# EasyEDA Pro project ProPrj_auduino温控灯扩展板_2024-11-21.epro

# Schematic Sheet_1_2024-11-05_ascii
Board Name: Sheet_1_2024-11-05_ascii; Create Date: 2024-11-08; Page Name: Sheet_1_2024-11-05_ascii; Project Name: auduino温控灯扩展板; Schematic Name: Sheet_1_2024-11-05_ascii; Update Date: 2024-11-08
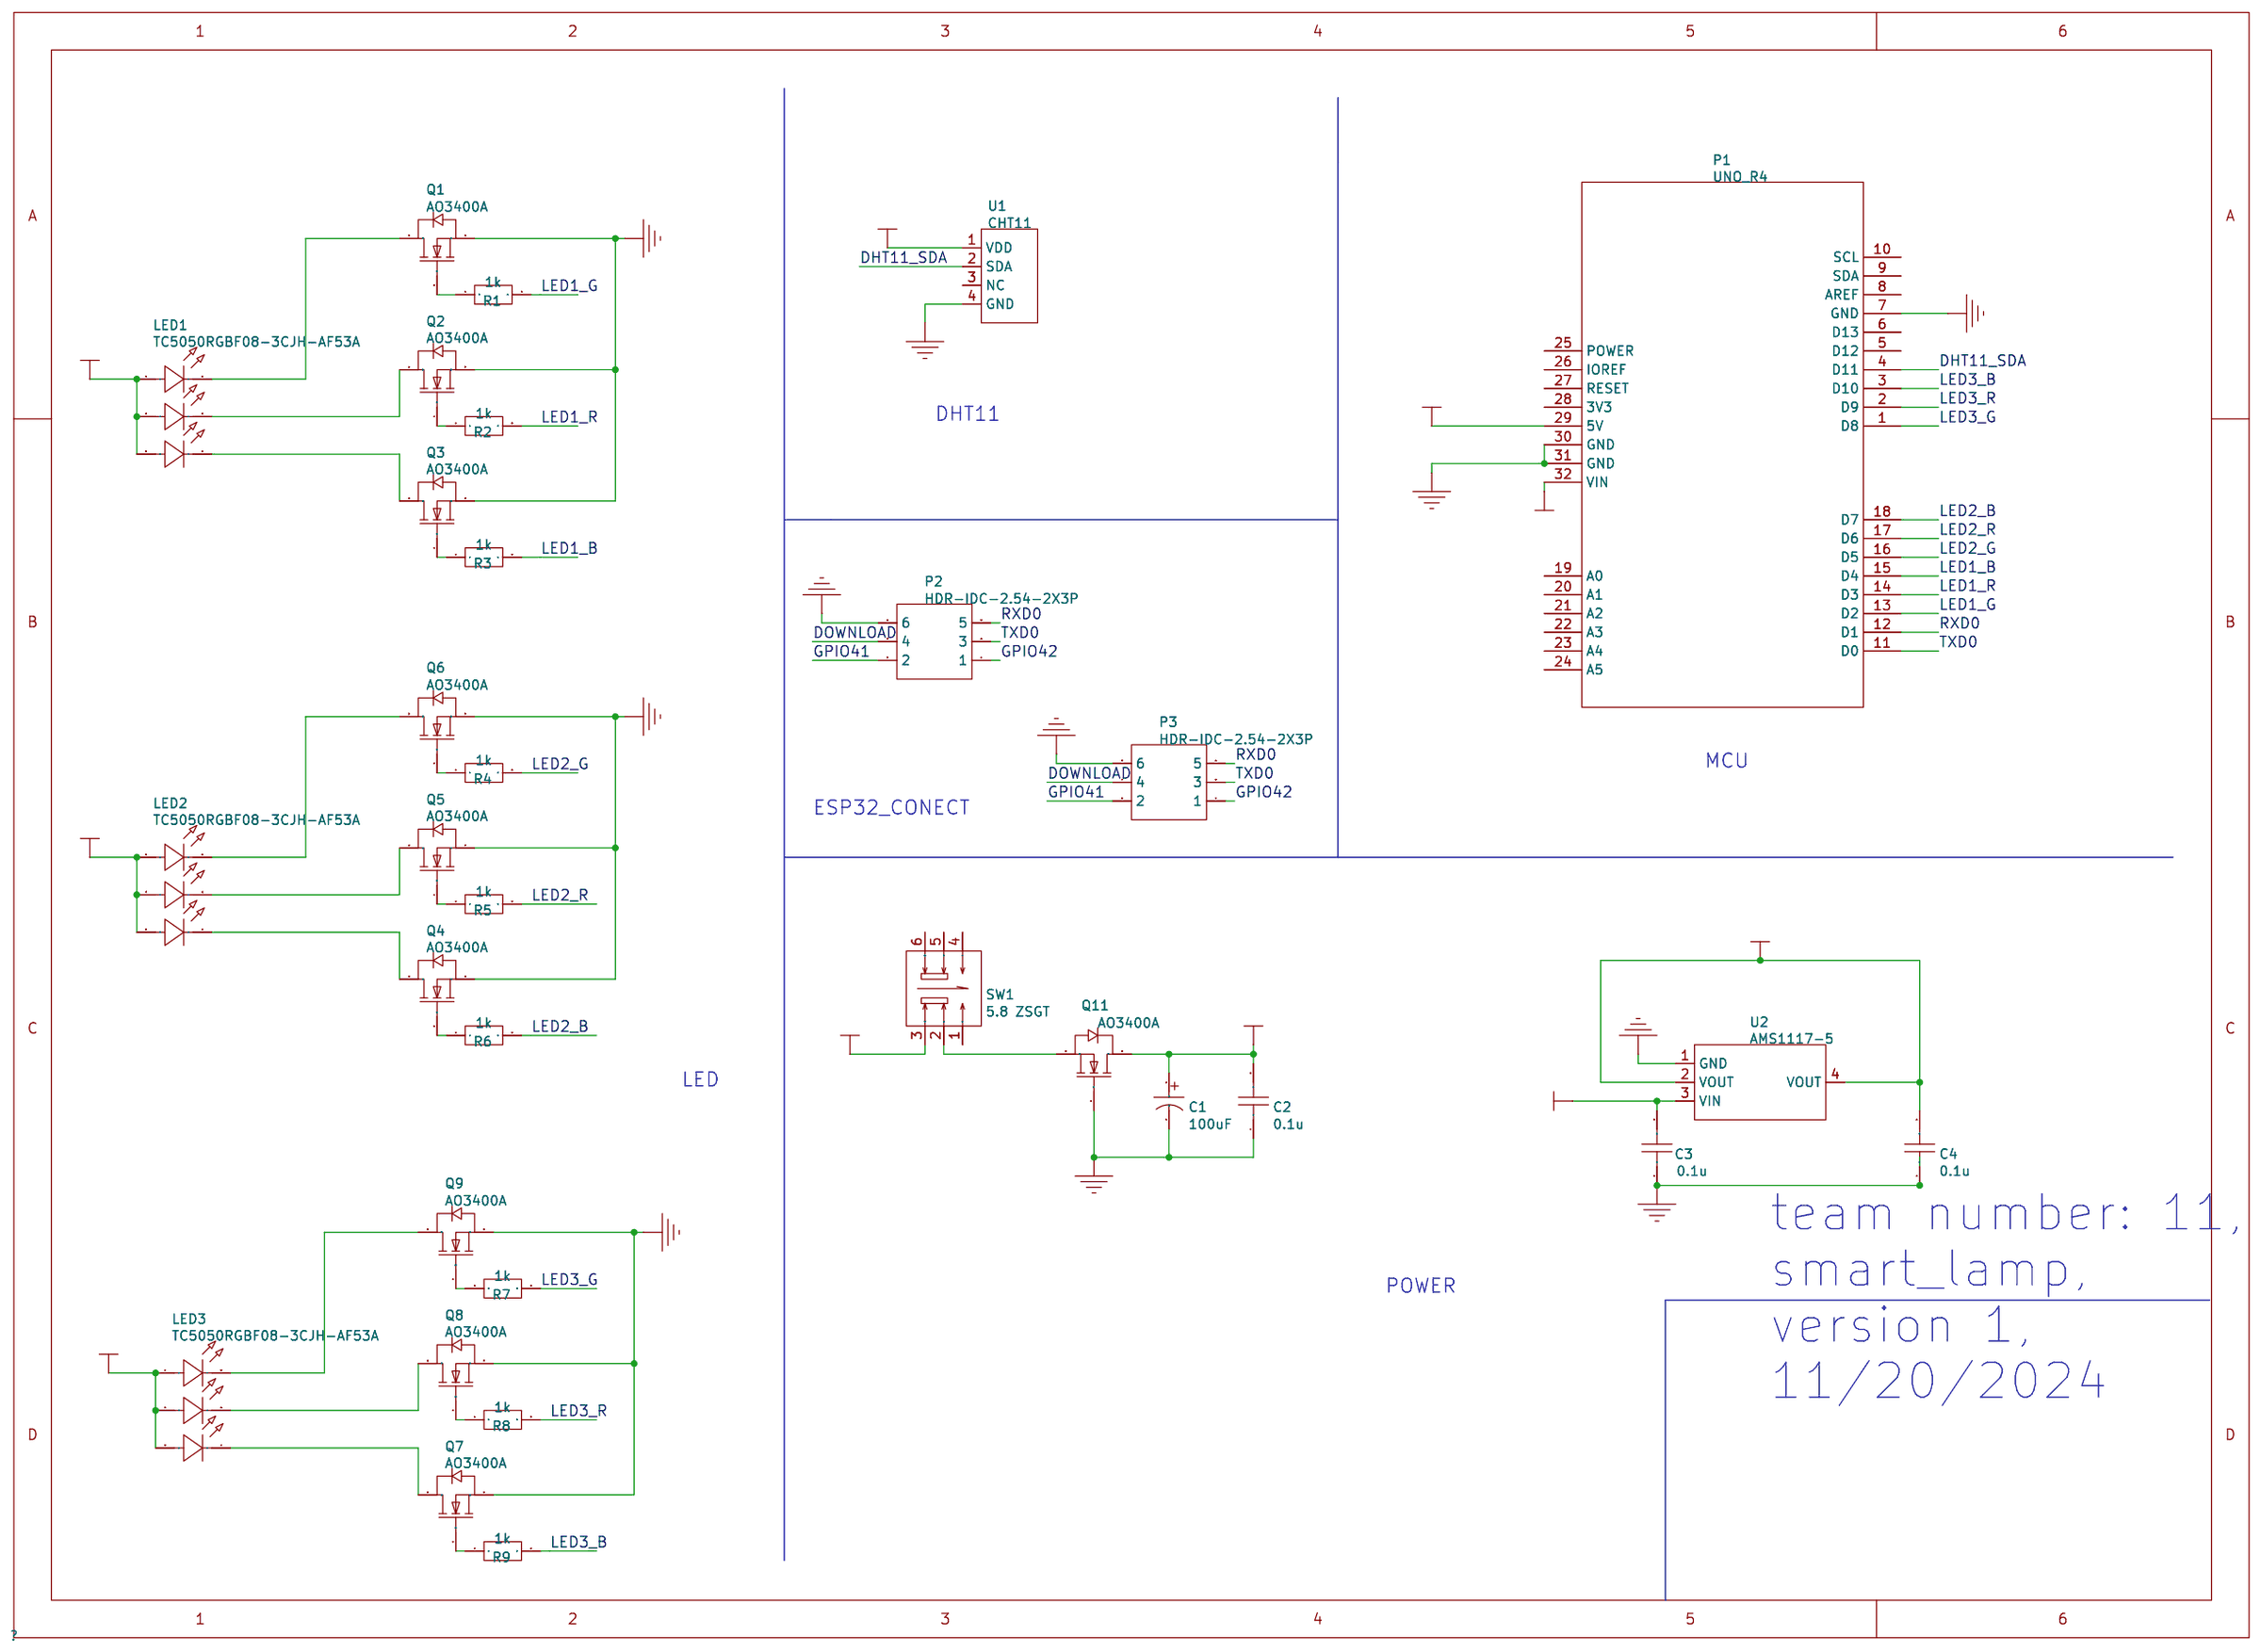
[diagram p0: schematic sheet]

## Parts
C1  100uF  [CAP-TH_BD6.3-P2.50-D1.0-FD]
C2  0.1u  [C0603]
C3  0.1u  [C0603]
C4  0.1u  [C0603]
LED1  TC5050RGBF08-3CJH-AF53A  [LED-SMD_6P-L5.0-W5.0-TL_TC5050RGBF08]
LED2  TC5050RGBF08-3CJH-AF53A  [LED-SMD_6P-L5.0-W5.0-TL_TC5050RGBF08]
LED3  TC5050RGBF08-3CJH-AF53A  [LED-SMD_6P-L5.0-W5.0-TL_TC5050RGBF08]
P1  UNO_R4  [UNO_R3]
P2  HDR-IDC-2.54-2X3P  [HDR-M-2.54_2X3]
P3  HDR-IDC-2.54-2X3P  [HDR-M-2.54_2X3]
Q1  AO3400A  [SOT-23-3_L2.9-W1.3-P1.90-LS2.4-BR]
Q2  AO3400A  [SOT-23-3_L2.9-W1.3-P1.90-LS2.4-BR]
Q3  AO3400A  [SOT-23-3_L2.9-W1.3-P1.90-LS2.4-BR]
Q4  AO3400A  [SOT-23-3_L2.9-W1.3-P1.90-LS2.4-BR]
Q5  AO3400A  [SOT-23-3_L2.9-W1.3-P1.90-LS2.4-BR]
Q6  AO3400A  [SOT-23-3_L2.9-W1.3-P1.90-LS2.4-BR]
Q7  AO3400A  [SOT-23-3_L2.9-W1.3-P1.90-LS2.4-BR]
Q8  AO3400A  [SOT-23-3_L2.9-W1.3-P1.90-LS2.4-BR]
Q9  AO3400A  [SOT-23-3_L2.9-W1.3-P1.90-LS2.4-BR]
Q11  AO3400A  [SOT-23-3_L2.9-W1.3-P1.90-LS2.4-BR]
R1  1k  [R0603]
R2  1k  [R0603]
R3  1k  [R0603]
R4  1k  [R0603]
R5  1k  [R0603]
R6  1k  [R0603]
R7  1k  [R0603]
R8  1k  [R0603]
R9  1k  [R0603]
SW1  5.8 ZSGT  [SW-TH_5.8ZSGT]
U1  CHT11  [footprint_0751]
U2  AMS1117-5  [SOT-223-3_L6.5-W3.4-P2.30-LS7.0-BR]

## Library data of the parts
C1 = 100uF: Supplier: LCSC; Manufacturer: CX(承兴); Manufacturer Part: GR107V025E11RR0VH4FP0; Supplier Part: C44601; JLCPCB Part Class: Extended Part
C2-C4 = 0.1u
LED1-LED3 = TC5050RGBF08-3CJH-AF53A: Supplier: LCSC; Supplier Part: C784540; Manufacturer: TCWIN(天成); JLCPCB Part Class: Extended Part
P1 = UNO_R4
P2 P3 = HDR-IDC-2.54-2X3P: Supplier: LCSC; Manufacturer: BOOMELE; Manufacturer Part: 2X3 2.54mm IDC Box; image: //image.lceda.cn/szlcsc/C11214.jpg; Supplier Part: C11214
Q1-Q9 Q11 = AO3400A: Supplier: LCSC; Manufacturer: AOS; Supplier Part: C20917; JLCPCB Part Class: Basic Part
R1-R9 = 1k
SW1 = 5.8 ZSGT: Supplier: LCSC; Supplier Part: C2681587; Manufacturer: SHOU HAN(首韩); JLCPCB Part Class: Extended Part
U1 = CHT11: Supplier: LCSC; Supplier Part: C476208; Manufacturer: CYBERSEN(西博臣); JLCPCB Part Class: Extended Part
U2 = AMS1117-5: Supplier: LCSC; Manufacturer: AMS; Manufacturer Part: AMS1117-3.3; Supplier Part: C6186; JLCPCB Part Class: Basic Part

## Nets
+5V: C4.2 LED1.1(+) LED1.2(+) LED1.3(+) LED2.1(+) LED2.2(+) LED2.3(+) LED3.1(+) LED3.2(+) LED3.3(+) P1.29(5V) U1.1(VDD) U2.2(VOUT) U2.4(VOUT)
GND: C1.2 C2.1 C3.1 C4.1 P1.7(GND) P1.30(GND) P1.31(GND) P2.6 P3.6 Q1.2(S) Q2.2(S) Q3.2(S) Q4.2(S) Q5.2(S) Q6.2(S) Q7.2(S) Q8.2(S) Q9.2(S) Q11.1(G) U1.4(GND) U2.1(GND)
VBAT: C1.1 C2.2 C3.2 Q11.3(D) U2.3(VIN)
VIN: P1.32(VIN) SW1.3
DHT11_SDA: P1.4(D11) U1.2(SDA)
DOWNLOAD: P2.4 P3.4
GPIO41: P2.2 P3.2
GPIO42: P2.1 P3.1
LED1_B: P1.15(D4) R3.2
LED1_G: P1.13(D2) R1.2
LED1_R: P1.14(D3) R2.2
LED2_B: P1.18(D7) R6.2
LED2_G: P1.16(D5) R4.2
LED2_R: P1.17(D6) R5.2
LED3_B: P1.3(D10) R9.2
LED3_G: P1.1(D8) R7.2
LED3_R: P1.2(D9) R8.2
RXD0: P1.12(D1) P2.5 P3.5
TXD0: P1.11(D0) P2.3 P3.3
LED2_4: LED2.4(-) Q4.3(D)
LED2_5: LED2.5(-) Q5.3(D)
LED2_6: LED2.6(-) Q6.3(D)
LED3_4: LED3.4(-) Q7.3(D)
LED3_5: LED3.5(-) Q8.3(D)
LED3_6: LED3.6(-) Q9.3(D)
Q1_1: Q1.1(G) R1.1
Q1_3: LED1.6(-) Q1.3(D)
Q2_1: Q2.1(G) R2.1
Q2_3: LED1.5(-) Q2.3(D)
Q3_1: Q3.1(G) R3.1
Q3_3: LED1.4(-) Q3.3(D)
Q4_1: Q4.1(G) R6.1
Q5_1: Q5.1(G) R5.1
Q6_1: Q6.1(G) R4.1
Q7_1: Q7.1(G) R9.1
Q8_1: Q8.1(G) R8.1
Q9_1: Q9.1(G) R7.1
SW1_2: Q11.2(S) SW1.2

Not connected (* = marked no-connect by the designer): P1 5(D12) 6(D13) 8(AREF) 9(SDA) 10(SCL) 19(A0) 20(A1) 21(A2) 22(A3) 23(A4) 24(A5) 25(POWER) 26(IOREF) 27(RESET) 28(3V3); SW1 1 4 5 6; U1 3(NC)

## Notes on the sheet
- DHT11
- MCU
- ESP32_CONECT
- LED
- POWER
- team number: 11,
  smart_lamp,
  version 1,
  11/20/2024

# Board PCB_adrino_2024-11-05_ascii
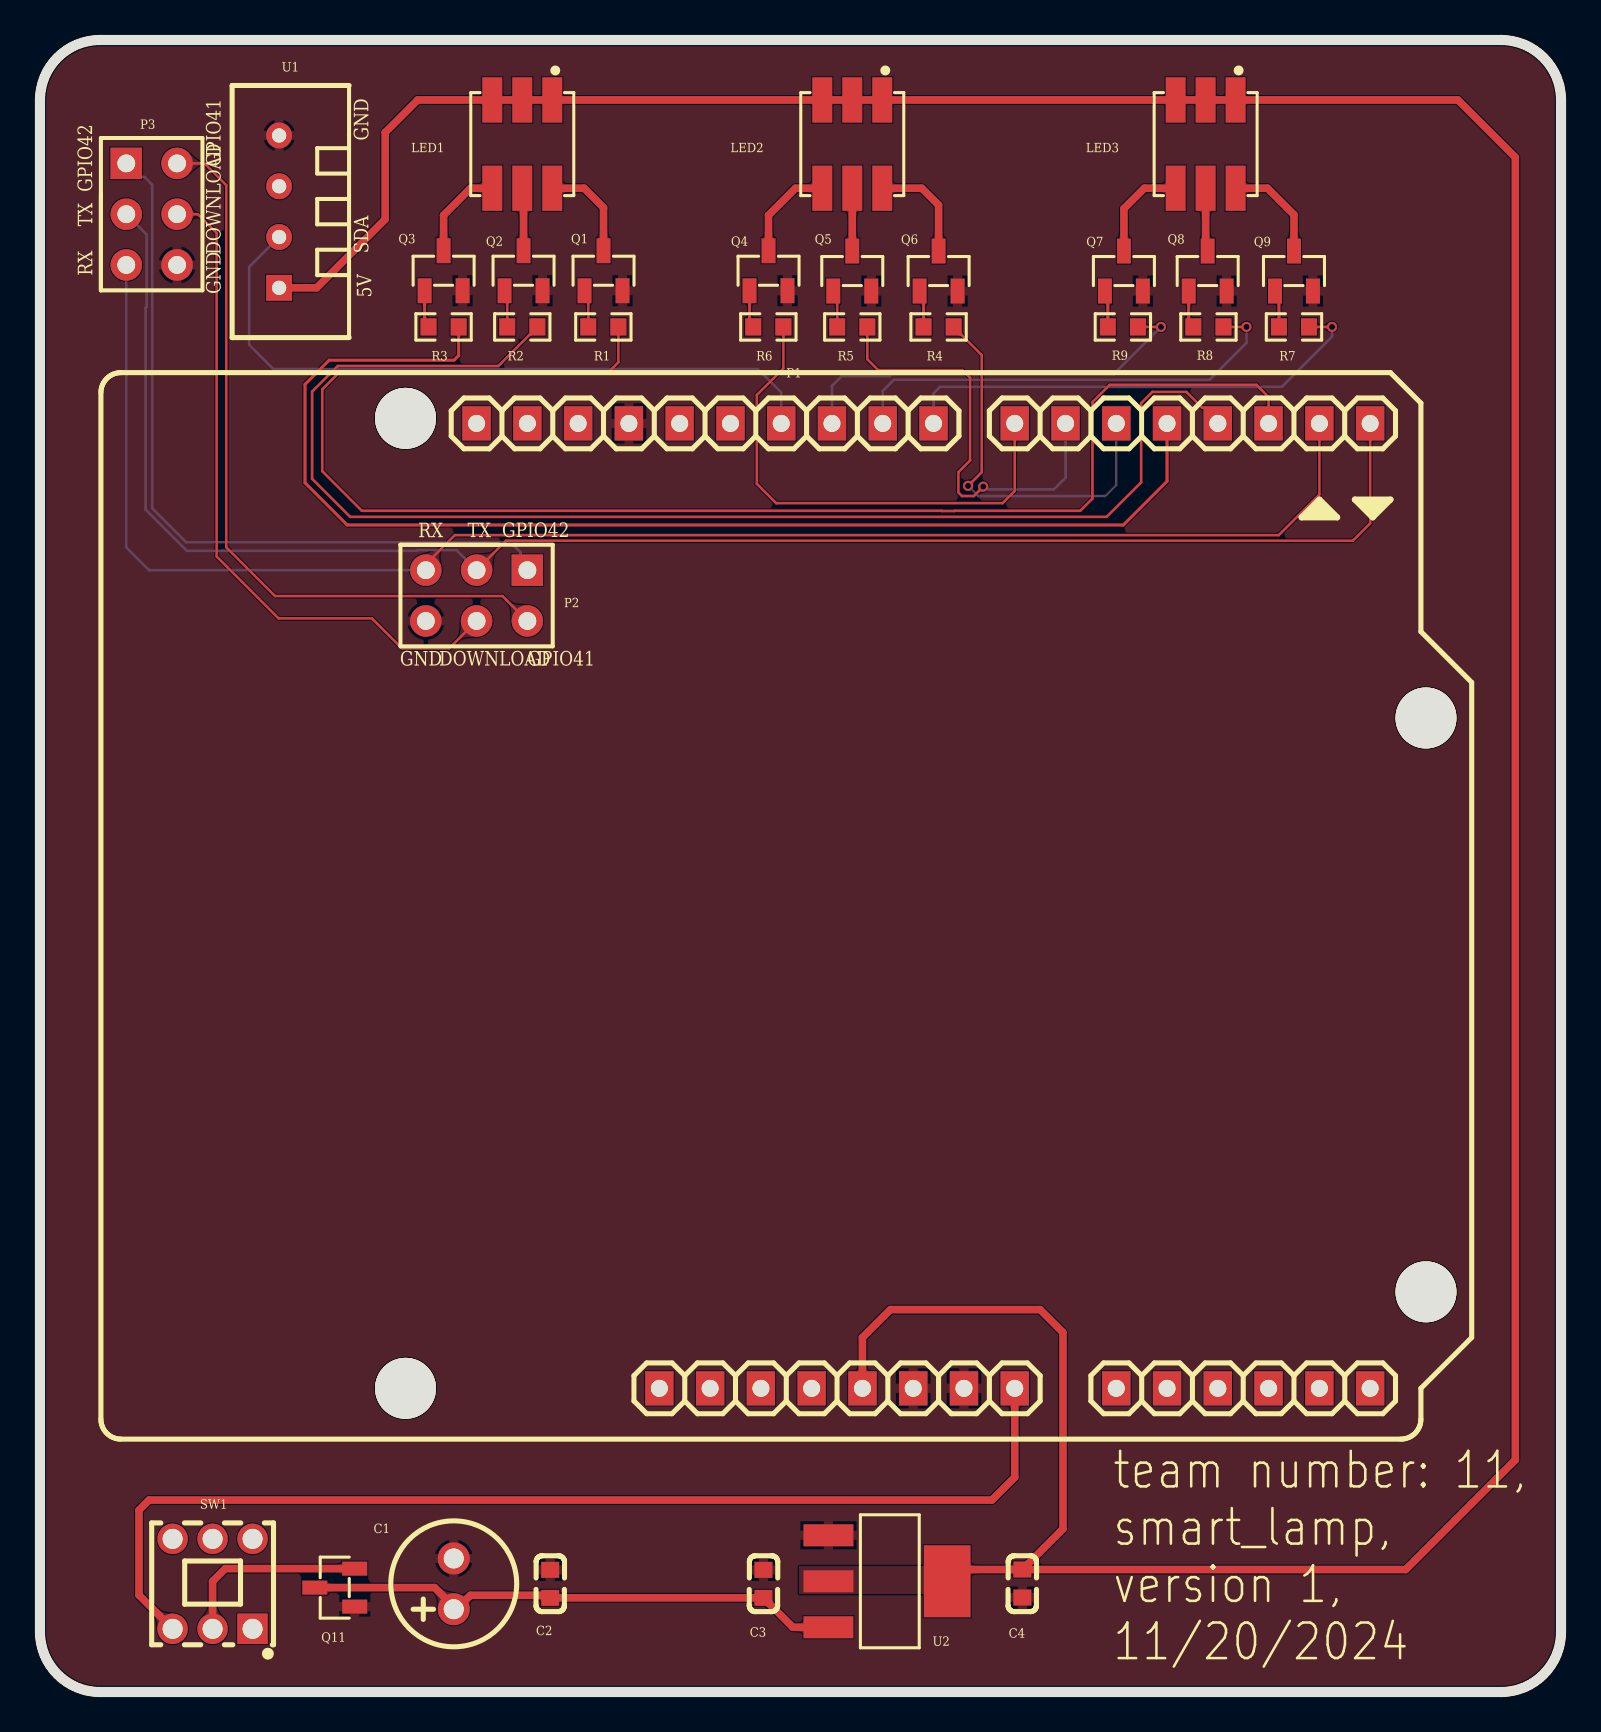
[diagram p1: board, top side]
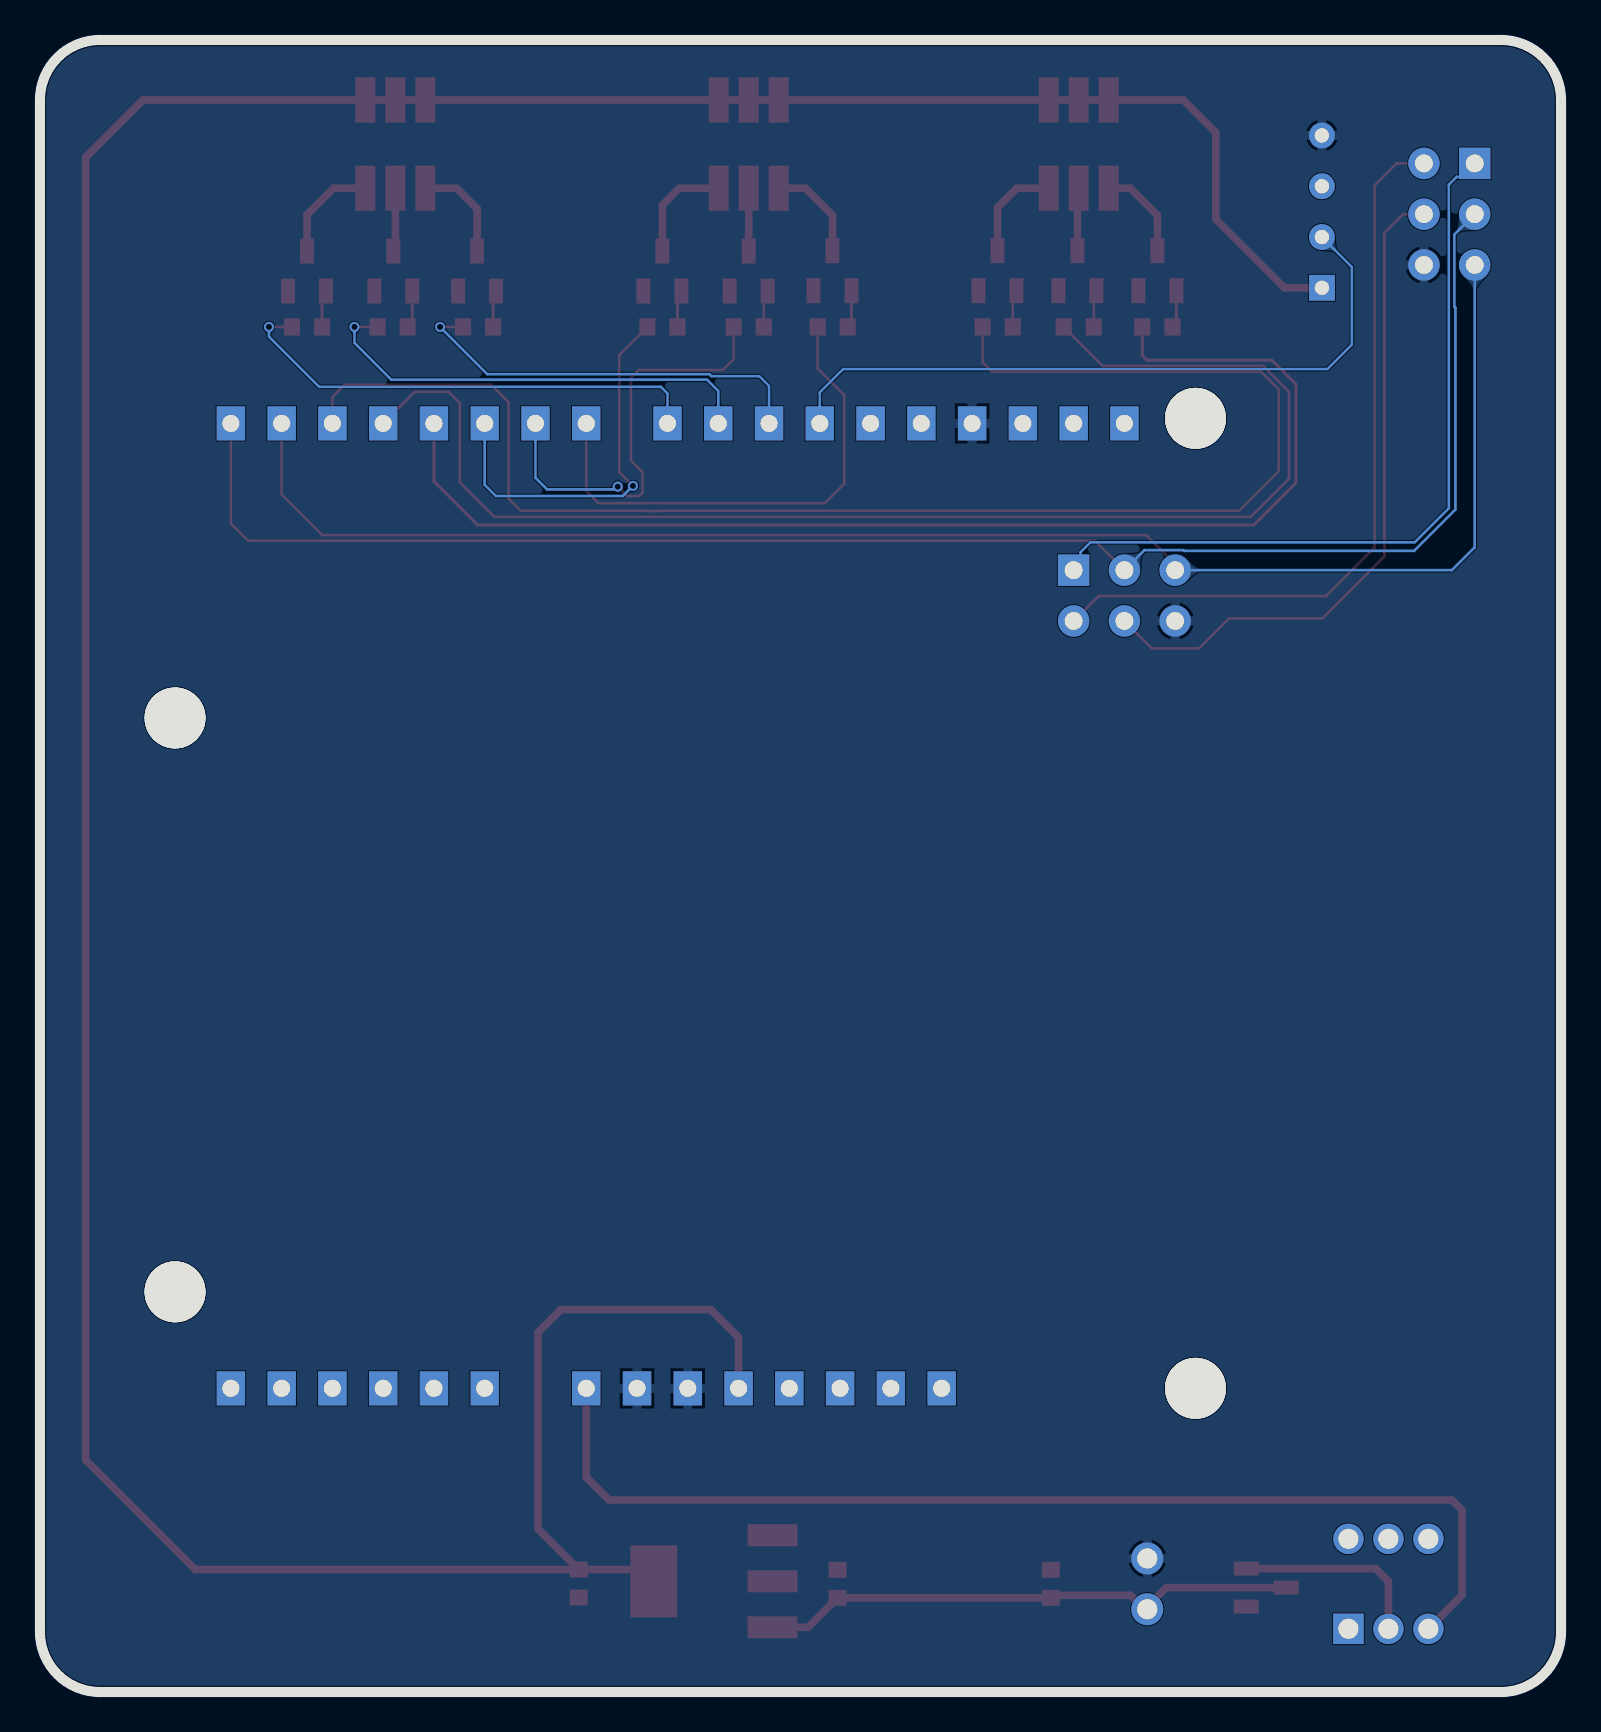
[diagram p2: board, bottom side, seen from below]

Outline 76.1 x 82.63 mm; copper layers: Top Layer, Bottom Layer. Coordinates in mm from the lower left corner of the outline.
Outline path: 0,79.63 0,3 arc(0.88,0.88) 3,0 73.1,0 arc(75.22,0.88) 76.1,3 76.1,79.63 arc(75.22,81.75) 73.1,82.63 3,82.63 arc(0.88,81.75) 0,79.63
Stack: Top Layer 0.0356mm / Dielectric1 0.32mm FR-4 er 4.8 / Bottom Layer 0.0356mm

## Design rules (mm)
net R9: Top Side Components
net R8: Top Side Components
net R7: Top Side Components
net R6: Top Side Components
net R5: Top Side Components
net R4: Top Side Components
net R3: Top Side Components
net R2: Top Side Components
net R1: Top Side Components
net U2: Top Side Components
net U1: Top Side Components
net SW1: Top Side Components
net Q11: Top Side Components
net Q9: Top Side Components
net Q8: Top Side Components
net Q7: Top Side Components
net Q6: Top Side Components
net Q5: Top Side Components
net Q4: Top Side Components
net Q3: Top Side Components
net Q2: Top Side Components
net Q1: Top Side Components
net P3: Top Side Components
net P2: Top Side Components
net P1: Top Side Components
net LED3: Top Side Components
net LED2: Top Side Components
net LED1: Top Side Components
net C4: Top Side Components
net C3: Top Side Components
net C2: Top Side Components
net C1: Top Side Components
spacing Clearance (default): track to track 0.152, other pairs 0.152 to 0.152
track width Width (default): min 0.127, default 0.152, max 0.762
differential pair DiffPairsRouting (default): width min 0.381, default 0.381, max 0.381; gap min 0.254, default 0.254
via RoutingVias (default): diameter min 0.508, default 0.508, max 0.508; hole min 0.305, default 0.305, max 0.305

## Placement (name value [footprint] x y rotation side)
C1  100uF  [CAP-TH_BD6.3-P2.50-D1.0-FD]  20.7 5.41 90 top
C2  0.1u  [C0603]  25.53 5.41 270 top
C3  0.1u  [C0603]  36.2 5.41 270 top
C4  0.1u  [C0603]  49.15 5.43 90 top
LED1  TC5050RGBF08-3CJH-AF53A  [LED-SMD_6P-L5.0-W5.0-TL_TC5050RGBF08]  24.13 77.42 270 top
LED2  TC5050RGBF08-3CJH-AF53A  [LED-SMD_6P-L5.0-W5.0-TL_TC5050RGBF08]  40.64 77.42 270 top
LED3  TC5050RGBF08-3CJH-AF53A  [LED-SMD_6P-L5.0-W5.0-TL_TC5050RGBF08]  58.32 77.42 270 top
P1  UNO_R4  [UNO_R3]  44.2 39.32 0 top
P2  HDR-IDC-2.54-2X3P  [HDR-M-2.54_2X3]  24.38 56.11 180 top
P3  HDR-IDC-2.54-2X3P  [HDR-M-2.54_2X3]  4.32 76.45 270 top
Q1  AO3400A  [SOT-23-3_L2.9-W1.3-P1.90-LS2.4-BR]  28.19 71.08 270 top
Q2  AO3400A  [SOT-23-3_L2.9-W1.3-P1.90-LS2.4-BR]  24.19 71.08 270 top
Q3  AO3400A  [SOT-23-3_L2.9-W1.3-P1.90-LS2.4-BR]  20.19 71.08 270 top
Q4  AO3400A  [SOT-23-3_L2.9-W1.3-P1.90-LS2.4-BR]  36.45 71.08 270 top
Q5  AO3400A  [SOT-23-3_L2.9-W1.3-P1.90-LS2.4-BR]  40.64 71.07 270 top
Q6  AO3400A  [SOT-23-3_L2.9-W1.3-P1.90-LS2.4-BR]  44.96 71.07 270 top
Q7  AO3400A  [SOT-23-3_L2.9-W1.3-P1.90-LS2.4-BR]  54.23 71.07 270 top
Q8  AO3400A  [SOT-23-3_L2.9-W1.3-P1.90-LS2.4-BR]  58.42 71.07 270 top
Q9  AO3400A  [SOT-23-3_L2.9-W1.3-P1.90-LS2.4-BR]  62.74 71.07 270 top
Q11  AO3400A  [SOT-23-3_L2.9-W1.3-P1.90-LS2.4-BR]  14.75 5.22 0 top
R1  1k  [R0603]  28.19 68.27 0 top
R2  1k  [R0603]  24.13 68.27 0 top
R3  1k  [R0603]  20.19 68.27 0 top
R4  1k  [R0603]  44.96 68.27 0 top
R5  1k  [R0603]  40.64 68.27 0 top
R6  1k  [R0603]  36.44 68.27 0 top
R7  1k  [R0603]  62.74 68.27 0 top
R8  1k  [R0603]  58.46 68.27 0 top
R9  1k  [R0603]  54.18 68.27 0 top
SW1  5.8 ZSGT  [SW-TH_5.8ZSGT]  8.64 5.41 0 top
U1  CHT11  [footprint_0751]  11.96 74.04 90 top
U2  AMS1117-5  [SOT-223-3_L6.5-W3.4-P2.30-LS7.0-BR]  42.42 5.54 180 top

## Footprints (pads in the part's own frame, mm; a bottom-side part is the same pattern mirrored in y, then rotated)
C0603
  rect 0.8x0.9 smd: 1(-0.7,0) 2(0.7,0)
CAP-TH_BD6.3-P2.50-D1.0-FD
  round 1.6 hole 1: 1(-1.27,0) 2(1.27,0)
footprint_0751
  rect 1.296x1.296 hole 0.711: 1(-3.81,0)
  round 1.296 hole 0.711: 2(-1.27,0) 3(1.27,0) 4(3.81,0)
HDR-M-2.54_2X3
  rect 1.575x1.575 hole 0.889: 1(0,0)
  round 1.575 hole 0.889: 2(0,2.54) 3(2.54,0) 4(2.54,2.54) 5(5.08,0) 6(5.08,2.54)
LED-SMD_6P-L5.0-W5.0-TL_TC5050RGBF08
  rect 2.265x1 smd: 1(-2.208,1.5) 2(-2.208,0) 3(-2.208,-1.5) 4(2.208,-1.5) 5(2.208,0) 6(2.208,1.5)
R0603
  rect 0.806x0.864 smd: 1(-0.753,0) 2(0.753,0)
SOT-23-3_L2.9-W1.3-P1.90-LS2.4-BR
  rect 1.25x0.7 smd: 1(1,-0.95) 2(1,0.95) 3(-1,0)
SOT-223-3_L6.5-W3.4-P2.30-LS7.0-BR
  rect 2.5x1.1 smd: 1(2.97,-2.3) 2(2.97,0) 3(2.97,2.3)
  rect 2.34x3.6 smd: 4(-2.97,0)
SW-TH_5.8ZSGT
  rect 1.524x1.524 hole 1: 1(2,-2.25)
  round 1.524 hole 1: 2(0,-2.25) 3(-2,-2.25) 4(2,2.25) 5(0,2.25) 6(-2,2.25)
UNO_R3
  round 3.048 hole 3.048: (-25.908,24.384) (-25.908,-24.13) (25.146,9.398) (25.146,-19.304)
  rect 1.423x1.707 hole 0.849: 1(0.508,24.13) 2(-2.032,24.13) 3(-4.572,24.13) 4(-7.112,24.13) 5(-9.652,24.13) 6(-12.192,24.13) 7(-14.732,24.13) 8(-17.272,24.13) 9(-19.812,24.13) 10(-22.352,24.13) 11(22.352,24.13) 12(19.812,24.13) 13(17.272,24.13) 14(14.732,24.13) 15(12.192,24.13) 16(9.652,24.13) 17(7.112,24.13) 18(4.572,24.13) 19(9.652,-24.13) 20(12.192,-24.13) 21(14.732,-24.13) 22(17.272,-24.13) 23(19.812,-24.13) 24(22.352,-24.13) 25(-13.208,-24.13) 26(-10.668,-24.13) 27(-8.128,-24.13) 28(-5.588,-24.13) 29(-3.048,-24.13) 30(-0.508,-24.13) 31(2.032,-24.13) 32(4.572,-24.13)

## Nets
As in the schematic.

Pads without a net: P1 5 6 8 9 10 19 20 21 22 23 24 25 26 27 28; SW1 1 4 5 6; U1 3

## Via types
v1: diameter 0.508, hole 0.305, Top Layer to Bottom Layer, 5 vias

## Routing (per net, layer and track width the routed paths; a pad name or vN(x,y) marks a point on that pad's centre or on a via; arc(x,y) is an arc through that point)
+5V: length 191.9
  Top Layer w0.381: P1.29 41.15,17.73 42.55,19.13 50.04,19.13 51.18,17.98 51.18,8.16 49.41,6.38 49.41,6.34 49.2,6.13 ; U1.1 13.84,70.23 17.27,73.66 17.27,78 18.9,79.63 LED1.3 LED1.2 LED1.1 LED2.3 LED2.2 LED2.1 LED3.3 LED3.2 LED3.1 70.94,79.63 73.81,76.76 73.81,11.61 68.33,6.13 49.2,6.13 ; U2.4 45.98,6.13 C4.2 49.2,6.13
VBAT: length 27
  Top Layer w0.381: U2.3 37.67,3.24 36.45,4.45 36.45,4.5 36.24,4.71 C3.2 C2.2 ; 25.53,4.84 21.53,4.84 20.96,4.27 20.7,4.27 19.75,5.22 Q11.3
VIN: length 55.6
  Top Layer w0.381: SW1.3 4.95,4.84 4.95,9.09 5.46,9.6 47.63,9.6 48.77,10.74 P1.32
DHT11_SDA: length 35.2
  Bottom Layer w0.127: P1.4 37.08,65 35.92,66.17 11.68,66.17 10.47,67.39 10.47,71.27 U1.2
DOWNLOAD: length 34
  Top Layer w0.127: 6.86,73.91 7.9,73.91 8.84,72.97 8.84,56.79 11.94,53.7 16.61,53.7 18.11,52.2 20.47,52.2 P2.4
GPIO41: length 37.6
  Top Layer w0.127: P2.2 23.14,54.81 11.76,54.81 9.32,57.25 9.32,75.36 8.23,76.45 P3.2
GPIO42: length 38.3
  Bottom Layer w0.127: P2.1 24.04,56.45 24.04,57.01 23.55,57.51 7.31,57.51 5.61,59.21 5.61,75.39 5.22,75.78 4.99,75.78 P3.1
LED1_B: length 62.4
  Top Layer w0.152: R3.2 20.95,66.84 20.71,66.61 14.47,66.61 13.26,65.41 13.26,60.48 15.37,58.37 54.2,58.37 56.39,60.55 P1.15
LED1_G: length 76.4
  Top Layer w0.127: R1.2 28.94,66.5 28.47,66.04 15.01,66.04 14.12,65.15 14.12,61.06 16.1,59.08 45.12,59.08 45.13,59.07 45.75,59.07 45.76,59.08 52.04,59.08 52.65,59.69 52.65,64.52 53.52,65.38 60.86,65.38 61.47,64.77 P1.13
LED1_R: length 68.7
  Top Layer w0.127: P1.14 58.93,63.59 58.28,64.24 58.14,64.24 57.35,65.02 55.65,65.02 55.09,64.47 55.09,60.5 53.37,58.78 15.52,58.78 13.61,60.68 13.61,65.04 14.9,66.32 22.93,66.32 24.51,67.91 24.54,67.91 24.88,68.25 R2.2
LED2_4: length 5
  Top Layer w0.381: LED2.4 37.8,75.21 36.45,73.86 Q4.3
LED2_5: length 3.1
  Top Layer w0.381: Q5.3 LED2.5
LED2_6: length 5.5
  Top Layer w0.381: Q6.3 44.96,74.37 44.12,75.21 LED2.6
LED2_B: length 25.3
  Top Layer w0.127: 37.19,68.27 37.19,66.2 35.86,64.87 35.86,60.43 36.83,59.46 48.16,59.46 48.77,60.07 P1.18
LED2_G: length 19.8
  Top Layer w0.127: R4.2 45.71,68.25 46.05,67.91 46.08,67.91 47.12,66.87 47.12,61.01 v1(46.43,60.33)
  Bottom Layer w0.127: P1.16 53.85,60.38 53.29,59.82 46.94,59.82 v1(46.43,60.33)
LED2_R: length 21.8
  Top Layer w0.127: R5.2 41.39,66.66 41.94,66.12 46.15,66.12 46.53,65.73 46.53,61.59 45.95,61.01 45.95,59.99 46.13,59.82 46.72,59.82 v1(47.19,60.29)
  Bottom Layer w0.127: v1(47.19,60.29) 47.3,60.29 47.44,60.15 50.72,60.15 51.31,60.73 P1.17
LED3_4: length 5.1
  Top Layer w0.381: Q7.3 54.23,74.19 55.25,75.21 LED3.4
LED3_5: length 3.2
  Top Layer w0.381: Q8.3 58.32,72.17 LED3.5
LED3_6: length 5.3
  Top Layer w0.381: LED3.6 61.42,75.21 62.74,73.89 Q9.3
LED3_B: length 20.7
  Top Layer w0.127: R9.2 v1(56.08,68.27)
  Bottom Layer w0.127: P1.3 39.62,65.33 40.11,65.81 42.51,65.81 42.61,65.91 53.72,65.91 v1(56.08,68.27)
LED3_G: length 24.3
  Top Layer w0.127: R7.2 v1(64.64,68.27)
  Bottom Layer w0.127: v1(64.64,68.27) 64.64,67.79 62.13,65.28 45.03,65.28 44.7,64.95 P1.1
LED3_R: length 22.8
  Top Layer w0.127: R8.2 v1(60.36,68.27)
  Bottom Layer w0.127: v1(60.36,68.27) 60.36,67.47 58.52,65.63 42.72,65.63 42.16,65.07 P1.2
Q1_1: length 1.9
  Top Layer w0.127: R1.1 27.43,69.9 Q1.1
Q1_3: length 5.1
  Top Layer w0.381: LED1.6 27.23,75.21 28.19,74.24 Q1.3
Q2_1: length 1.9
  Top Layer w0.127: Q2.1 23.38,69.95 23.38,68.27
Q2_3: length 3.2
  Top Layer w0.381: LED1.5 24.19,75.15 Q2.3
Q3_1: length 1.9
  Top Layer w0.152: R3.1 19.24,68.47 Q3.1
Q3_3: length 4.8
  Top Layer w0.381: Q3.3 20.19,73.86 21.54,75.21 LED1.4
Q4_1: length 1.9
  Top Layer w0.152: R6.1 35.5,68.46 Q4.1
Q5_1: length 1.9
  Top Layer w0.127: Q5.1 39.89,69.87 R5.1
Q6_1: length 1.9
  Top Layer w0.152: 44.2,68.27 44.2,69.87 Q6.1
Q7_1: length 1.9
  Top Layer w0.152: 53.42,68.27 53.42,69.92 Q7.1
Q8_1: length 1.8
  Top Layer w0.152: 57.7,68.27 57.47,68.51 57.47,69.93
Q9_1: length 1.9
  Top Layer w0.152: 61.98,68.27 61.98,69.87 Q9.1
RXD0: length 79.6
  Top Layer w0.127: P1.12 64.01,59.89 61.98,57.86 20.75,57.86 19.3,56.41 P2.5
  Bottom Layer w0.127: P3.5 4.32,57.25 5.46,56.11 P2.5
SW1_2: length 9.8
  Top Layer w0.381: Q11.2 9.27,6.17 8.64,5.54 SW1.2
TXD0: length 83.7
  Top Layer w0.127: P1.11 66.55,58.44 65.68,57.58 23.32,57.58 P2.3
  Bottom Layer w0.127: P2.3 20.84,57.11 18.89,57.11 18.85,57.07 7.35,57.07 5.28,59.14 5.28,69.23 5.33,69.28 5.33,72.9 4.32,73.91

## Copper pours and planes (outline as drawn; the poured copper is in the pictures)
+5V on Top Layer: 37.97,6.3 46.23,6.3 46.23,4.9 37.97,4.9
GND on Top Layer: 3,0 0.88,0.88 0,3 0,79.63 0.88,81.75 3,82.63 73.1,82.63 75.22,81.75 76.1,79.63 76.1,3 75.22,0.88 73.1,0
GND on Bottom Layer: 3,0 0.88,0.88 0,3 0,79.63 0.88,81.75 3,82.63 73.1,82.63 75.22,81.75 76.1,79.63 76.1,3 75.22,0.88 73.1,0

Small or netless copper shapes (teardrops, artwork), in the pictures only: 75 on Top Layer, 17 on Bottom Layer

## Text on the board
Top Silkscreen Layer: team number: 11, / smart_lamp, / version 1, / 11/20/2024 | GND | RX | DOWNLOAD | TX | GPIO42 | GPIO41 | SDA | 5V
